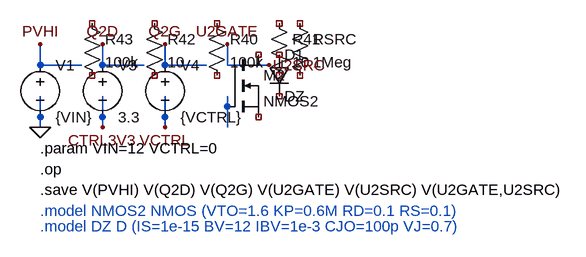
[diagram p0: schematic pv_switch_gate_drive.asc]
pv_switch_gate_drive.asc, the LTspice schematic file:
Version 4
SHEET 1 880 680
WIRE 64 112 64 80
WIRE 64 112 128 112
WIRE 160 112 160 80
WIRE 160 112 224 112
WIRE 256 112 256 80
WIRE 256 112 320 112
WIRE 352 112 352 80
WIRE 352 112 416 112
WIRE 64 208 64 160
WIRE 160 208 160 160
WIRE 256 208 256 160
WIRE 352 208 352 160
FLAG 64 208 0
FLAG 64 80 PVHI
FLAG 160 80 Q2D
FLAG 256 80 Q2G
FLAG 352 80 U2GATE
FLAG 416 112 U2SRC
FLAG 160 208 CTRL3V3
FLAG 256 208 VCTRL
SYMBOL voltage 64 96 R0
SYMATTR InstName V1
SYMATTR Value {VIN}
SYMBOL voltage 160 96 R0
SYMATTR InstName V3
SYMATTR Value 3.3
SYMBOL voltage 256 96 R0
SYMATTR InstName V4
SYMATTR Value {VCTRL}
SYMBOL res 128 32 R0
SYMATTR InstName R43
SYMATTR Value 100k
SYMBOL res 224 32 R0
SYMATTR InstName R42
SYMATTR Value 10
SYMBOL res 320 32 R0
SYMATTR InstName R40
SYMATTR Value 100k
SYMBOL res 416 32 R0
SYMATTR InstName R41
SYMATTR Value 10
SYMBOL nmos 352 96 R0
SYMATTR InstName M2
SYMATTR Value NMOS2
SYMBOL diode 416 96 R0
SYMATTR InstName D1
SYMATTR Value DZ
SYMBOL res 448 32 R0
SYMATTR InstName RSRC
SYMATTR Value 1Meg
TEXT 64 240 Left 2 !.param VIN=12 VCTRL=0
TEXT 64 272 Left 2 !.op
TEXT 64 304 Left 2 !.save V(PVHI) V(Q2D) V(Q2G) V(U2GATE) V(U2SRC) V(U2GATE,U2SRC)
TEXT 64 336 Left 2 ;.model NMOS2 NMOS (VTO=1.6 KP=0.6M RD=0.1 RS=0.1)
TEXT 64 360 Left 2 ;.model DZ D (IS=1e-15 BV=12 IBV=1e-3 CJO=100p VJ=0.7)

The netlist it stands for:
* pv_switch_gate_drive.asc
V1 PVHI 0 {VIN}
V3 Q2D CTRL3V3 3.3
V4 Q2G VCTRL {VCTRL}
R43 NC_01 NC_02 100k
R42 NC_03 NC_04 10
R40 NC_05 NC_06 100k
R41 NC_07 NC_08 10
* M2: NMOS2 (symbol nmos not certain, pin order unknown); nets seen at it: N001
D1 NC_11 NC_12 DZ
RSRC NC_13 NC_14 1Meg
.model D D
.lib standard.dio
.param VIN=12 VCTRL=0
.op
.save V(PVHI) V(Q2D) V(Q2G) V(U2GATE) V(U2SRC) V(U2GATE,U2SRC)
* .model NMOS2 NMOS (VTO=1.6 KP=0.6M RD=0.1 RS=0.1)
* .model DZ D (IS=1e-15 BV=12 IBV=1e-3 CJO=100p VJ=0.7)
.backanno
.end